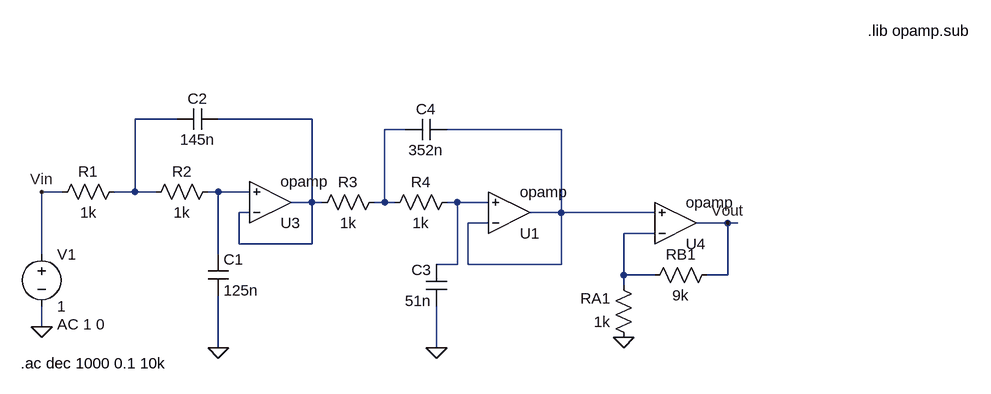
[diagram p0: schematic EJ3_3.asc]
EJ3_3.asc, the LTspice schematic file:
Version 4
SHEET 1 924 680
WIRE -448 0 -512 0
WIRE -240 0 -384 0
WIRE -96 16 -128 16
WIRE 144 16 -32 16
WIRE -624 112 -656 112
WIRE -512 112 -512 0
WIRE -512 112 -544 112
WIRE -480 112 -512 112
WIRE -384 112 -400 112
WIRE -336 112 -384 112
WIRE -240 128 -240 0
WIRE -240 128 -272 128
WIRE -224 128 -240 128
WIRE -128 128 -128 16
WIRE -128 128 -144 128
WIRE -112 128 -128 128
WIRE -16 128 -32 128
WIRE 32 128 -16 128
WIRE -336 144 -352 144
WIRE 144 144 144 16
WIRE 144 144 96 144
WIRE 288 144 144 144
WIRE 32 160 0 160
WIRE 400 160 352 160
WIRE 416 160 400 160
WIRE 288 176 240 176
WIRE -352 192 -352 144
WIRE -240 192 -240 128
WIRE -240 192 -352 192
WIRE -656 208 -656 112
WIRE -384 208 -384 112
WIRE -16 224 -16 128
WIRE -16 224 -48 224
WIRE 0 224 0 160
WIRE 144 224 144 144
WIRE 144 224 0 224
WIRE 240 240 240 176
WIRE 288 240 240 240
WIRE 400 240 400 160
WIRE 400 240 368 240
WIRE 240 256 240 240
WIRE -656 320 -656 288
WIRE -384 352 -384 272
WIRE -48 352 -48 288
FLAG -656 320 0
FLAG 240 336 0
FLAG -384 352 0
FLAG -48 352 0
FLAG -656 112 Vin
FLAG 400 160 Vout
SYMBOL voltage -656 192 R0
WINDOW 123 24 124 Left 2
WINDOW 39 0 0 Left 0
SYMATTR Value2 AC 1 0
SYMATTR InstName V1
SYMATTR Value 1
SYMBOL OpAmps\\opamp 64 208 M180
SYMATTR InstName U1
SYMBOL OpAmps\\opamp -304 192 M180
SYMATTR InstName U3
SYMBOL OpAmps\\opamp 320 224 M180
SYMATTR InstName U4
SYMBOL res -528 96 R90
WINDOW 0 0 56 VBottom 2
WINDOW 3 32 56 VTop 2
SYMATTR InstName R1
SYMATTR Value 1k
SYMBOL res -384 96 R90
WINDOW 0 0 56 VBottom 2
WINDOW 3 32 56 VTop 2
SYMATTR InstName R2
SYMATTR Value 1k
SYMBOL cap -400 208 R0
SYMATTR InstName C1
SYMATTR Value 125n
SYMBOL cap -384 -16 R90
WINDOW 0 0 32 VBottom 2
WINDOW 3 32 32 VTop 2
SYMATTR InstName C2
SYMATTR Value 145n
SYMBOL cap -32 288 R180
WINDOW 0 24 56 Left 2
WINDOW 3 24 8 Left 2
SYMATTR InstName C3
SYMATTR Value 51n
SYMBOL cap -32 0 R90
WINDOW 0 0 32 VBottom 2
WINDOW 3 32 32 VTop 2
SYMATTR InstName C4
SYMATTR Value 352n
SYMBOL res -128 112 R90
WINDOW 0 0 56 VBottom 2
WINDOW 3 32 56 VTop 2
SYMATTR InstName R3
SYMATTR Value 1k
SYMBOL res -16 112 R90
WINDOW 0 0 56 VBottom 2
WINDOW 3 32 56 VTop 2
SYMATTR InstName R4
SYMATTR Value 1k
SYMBOL res 256 352 R180
WINDOW 0 36 76 Left 2
WINDOW 3 36 40 Left 2
SYMATTR InstName RA1
SYMATTR Value 1k
SYMBOL res 272 256 R270
WINDOW 0 32 56 VTop 2
WINDOW 3 0 56 VBottom 2
SYMATTR InstName RB1
SYMATTR Value 9k
TEXT 616 -136 Left 2 !.lib opamp.sub
TEXT -688 376 Left 2 !.ac dec 1000 0.1 10k

The netlist it stands for:
* EJ3_3.asc
V1 Vin 0 1 AC 1 0
XU1 N004 N006 N004 opamp Aol=100K GBW=10Meg  ; pins invin noninvin out
XU3 N002 N005 N002 opamp Aol=100K GBW=10Meg  ; pins invin noninvin out
XU4 N007 N004 Vout opamp Aol=100K GBW=10Meg  ; pins invin noninvin out
R1 N001 Vin 1k
R2 N005 N001 1k
C1 N005 0 125n
C2 N002 N001 145n
C3 0 N006 51n
C4 N004 N003 352n
R3 N003 N002 1k
R4 N006 N003 1k
RA1 0 N007 1k
RB1 N007 Vout 9k
.lib opamp.sub
.ac dec 1000 0.1 10k
.backanno
.end